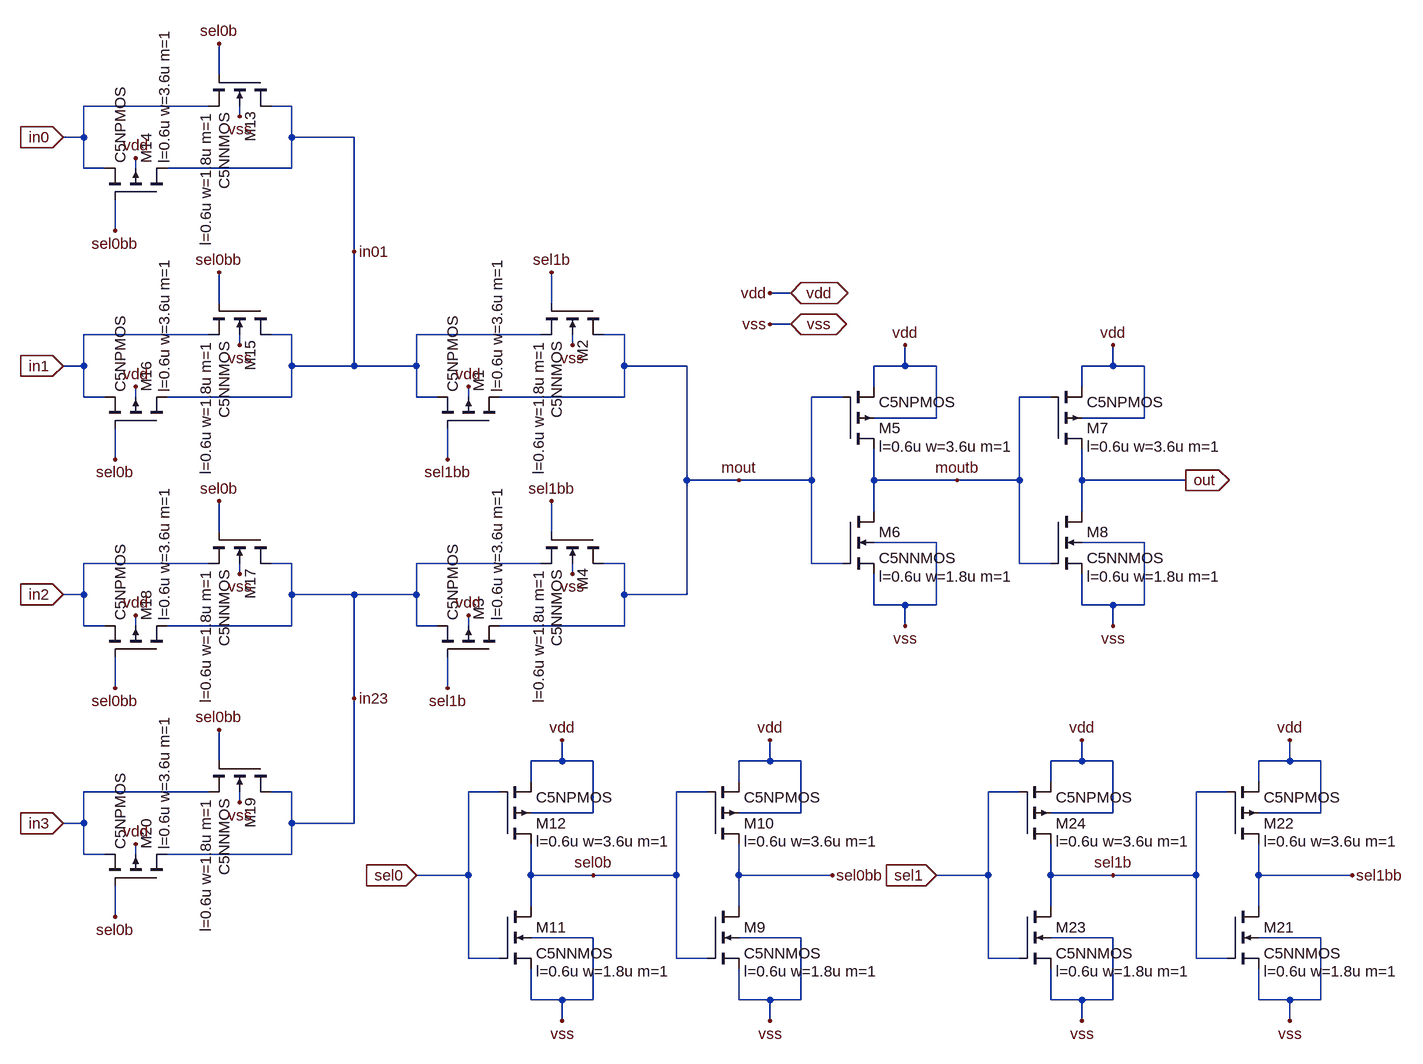
[diagram p0: schematic mux4to1_1x.asc]
mux4to1_1x.asc, the LTspice schematic file:
Version 4
SHEET 1 1484 1076
WIRE -352 -464 -352 -512
WIRE -368 -416 -560 -416
WIRE -240 -416 -272 -416
WIRE -320 -400 -320 -416
WIRE -560 -368 -560 -416
WIRE -560 -368 -592 -368
WIRE -240 -368 -240 -416
WIRE -144 -368 -240 -368
WIRE -560 -320 -560 -368
WIRE -528 -320 -560 -320
WIRE -480 -320 -480 -336
WIRE -240 -320 -240 -368
WIRE -240 -320 -432 -320
WIRE -512 -224 -512 -272
WIRE -144 -192 -144 -368
WIRE 528 -128 496 -128
WIRE -352 -112 -352 -160
WIRE 160 -112 160 -160
WIRE 528 -80 496 -80
WIRE -368 -64 -560 -64
WIRE -240 -64 -272 -64
WIRE 144 -64 -48 -64
WIRE 272 -64 240 -64
WIRE -320 -48 -320 -64
WIRE 192 -48 192 -64
WIRE -560 -16 -560 -64
WIRE -560 -16 -592 -16
WIRE -240 -16 -240 -64
WIRE -144 -16 -144 -192
WIRE -144 -16 -240 -16
WIRE -48 -16 -48 -64
WIRE -48 -16 -144 -16
WIRE 272 -16 272 -64
WIRE 368 -16 272 -16
WIRE 704 -16 704 -48
WIRE 704 -16 656 -16
WIRE 752 -16 704 -16
WIRE 1024 -16 1024 -48
WIRE 1024 -16 976 -16
WIRE 1072 -16 1024 -16
WIRE 656 16 656 -16
WIRE 976 16 976 -16
WIRE -560 32 -560 -16
WIRE -528 32 -560 32
WIRE -480 32 -480 16
WIRE -240 32 -240 -16
WIRE -240 32 -432 32
WIRE -48 32 -48 -16
WIRE -16 32 -48 32
WIRE 32 32 32 16
WIRE 272 32 272 -16
WIRE 272 32 80 32
WIRE 608 32 560 32
WIRE 928 32 880 32
WIRE 752 64 752 -16
WIRE 752 64 656 64
WIRE 1072 64 1072 -16
WIRE 1072 64 976 64
WIRE -512 128 -512 80
WIRE 0 128 0 80
WIRE 368 160 368 -16
WIRE 448 160 368 160
WIRE 560 160 560 32
WIRE 560 160 448 160
WIRE 656 160 656 112
WIRE 784 160 656 160
WIRE 880 160 880 32
WIRE 880 160 784 160
WIRE 976 160 976 112
WIRE 1136 160 976 160
WIRE 656 208 656 160
WIRE 976 208 976 160
WIRE -352 240 -352 192
WIRE 160 240 160 192
WIRE 752 256 656 256
WIRE 1072 256 976 256
WIRE -368 288 -560 288
WIRE -240 288 -272 288
WIRE 144 288 -48 288
WIRE 272 288 240 288
WIRE 560 288 560 160
WIRE 608 288 560 288
WIRE 880 288 880 160
WIRE 928 288 880 288
WIRE -320 304 -320 288
WIRE 192 304 192 288
WIRE -560 336 -560 288
WIRE -560 336 -592 336
WIRE -240 336 -240 288
WIRE -144 336 -240 336
WIRE -48 336 -48 288
WIRE -48 336 -144 336
WIRE 272 336 272 288
WIRE 368 336 368 160
WIRE 368 336 272 336
WIRE 656 352 656 304
WIRE 704 352 656 352
WIRE 752 352 752 256
WIRE 752 352 704 352
WIRE 976 352 976 304
WIRE 1024 352 976 352
WIRE 1072 352 1072 256
WIRE 1072 352 1024 352
WIRE -560 384 -560 336
WIRE -528 384 -560 384
WIRE -480 384 -480 368
WIRE -240 384 -240 336
WIRE -240 384 -432 384
WIRE -48 384 -48 336
WIRE -16 384 -48 384
WIRE 32 384 32 368
WIRE 272 384 272 336
WIRE 272 384 80 384
WIRE 704 384 704 352
WIRE 1024 384 1024 352
WIRE -512 480 -512 432
WIRE 0 480 0 432
WIRE -144 496 -144 336
WIRE -352 592 -352 544
WIRE 176 592 176 560
WIRE 176 592 128 592
WIRE 224 592 176 592
WIRE 496 592 496 560
WIRE 496 592 448 592
WIRE 544 592 496 592
WIRE 976 592 976 560
WIRE 976 592 928 592
WIRE 1024 592 976 592
WIRE 1296 592 1296 560
WIRE 1296 592 1248 592
WIRE 1344 592 1296 592
WIRE 128 624 128 592
WIRE 448 624 448 592
WIRE 928 624 928 592
WIRE 1248 624 1248 592
WIRE -368 640 -560 640
WIRE -240 640 -272 640
WIRE 80 640 32 640
WIRE 400 640 352 640
WIRE 880 640 832 640
WIRE 1200 640 1152 640
WIRE -320 656 -320 640
WIRE 224 672 224 592
WIRE 224 672 128 672
WIRE 544 672 544 592
WIRE 544 672 448 672
WIRE 1024 672 1024 592
WIRE 1024 672 928 672
WIRE 1344 672 1344 592
WIRE 1344 672 1248 672
WIRE -560 688 -560 640
WIRE -560 688 -592 688
WIRE -240 688 -240 640
WIRE -144 688 -144 496
WIRE -144 688 -240 688
WIRE -560 736 -560 688
WIRE -528 736 -560 736
WIRE -480 736 -480 720
WIRE -240 736 -240 688
WIRE -240 736 -432 736
WIRE 32 768 32 640
WIRE 32 768 -48 768
WIRE 128 768 128 720
WIRE 224 768 128 768
WIRE 352 768 352 640
WIRE 352 768 224 768
WIRE 448 768 448 720
WIRE 592 768 448 768
WIRE 832 768 832 640
WIRE 832 768 752 768
WIRE 928 768 928 720
WIRE 1024 768 928 768
WIRE 1152 768 1152 640
WIRE 1152 768 1024 768
WIRE 1248 768 1248 720
WIRE 1392 768 1248 768
WIRE 128 816 128 768
WIRE 448 816 448 768
WIRE 928 816 928 768
WIRE 1248 816 1248 768
WIRE -512 832 -512 784
WIRE 224 864 128 864
WIRE 544 864 448 864
WIRE 1024 864 928 864
WIRE 1344 864 1248 864
WIRE 32 896 32 768
WIRE 80 896 32 896
WIRE 352 896 352 768
WIRE 400 896 352 896
WIRE 832 896 832 768
WIRE 880 896 832 896
WIRE 1152 896 1152 768
WIRE 1200 896 1152 896
WIRE 128 960 128 912
WIRE 176 960 128 960
WIRE 224 960 224 864
WIRE 224 960 176 960
WIRE 448 960 448 912
WIRE 496 960 448 960
WIRE 544 960 544 864
WIRE 544 960 496 960
WIRE 928 960 928 912
WIRE 976 960 928 960
WIRE 1024 960 1024 864
WIRE 1024 960 976 960
WIRE 1248 960 1248 912
WIRE 1296 960 1248 960
WIRE 1344 960 1344 864
WIRE 1344 960 1296 960
WIRE 176 992 176 960
WIRE 496 992 496 960
WIRE 976 992 976 960
WIRE 1296 992 1296 960
FLAG 1136 160 out
IOPIN 1136 160 Out
FLAG 528 -80 vss
IOPIN 528 -80 BiDir
FLAG 528 -128 vdd
IOPIN 528 -128 BiDir
FLAG 160 -160 sel1b
FLAG 0 128 sel1bb
FLAG 0 480 sel1b
FLAG 160 192 sel1bb
FLAG 704 -48 vdd
FLAG 1024 -48 vdd
FLAG 704 384 vss
FLAG 1024 384 vss
FLAG 192 -48 vss
FLAG 32 16 vdd
FLAG 32 368 vdd
FLAG 192 304 vss
FLAG 496 -128 vdd
FLAG 496 -80 vss
FLAG 176 560 vdd
FLAG 496 560 vdd
FLAG 176 992 vss
FLAG 496 992 vss
FLAG -48 768 sel0
IOPIN -48 768 In
FLAG 224 768 sel0b
FLAG 592 768 sel0bb
FLAG -592 -368 in0
IOPIN -592 -368 In
FLAG -592 -16 in1
IOPIN -592 -16 In
FLAG -352 -512 sel0b
FLAG -512 -224 sel0bb
FLAG -512 128 sel0b
FLAG -352 -160 sel0bb
FLAG -320 -400 vss
FLAG -480 -336 vdd
FLAG -480 16 vdd
FLAG -320 -48 vss
FLAG -592 336 in2
IOPIN -592 336 In
FLAG -592 688 in3
IOPIN -592 688 In
FLAG -352 192 sel0b
FLAG -512 480 sel0bb
FLAG -512 832 sel0b
FLAG -352 544 sel0bb
FLAG -320 304 vss
FLAG -480 368 vdd
FLAG -480 720 vdd
FLAG -320 656 vss
FLAG 976 560 vdd
FLAG 1296 560 vdd
FLAG 976 992 vss
FLAG 1296 992 vss
FLAG 752 768 sel1
IOPIN 752 768 In
FLAG 1024 768 sel1b
FLAG 1392 768 sel1bb
FLAG -144 496 in23
FLAG -144 -192 in01
FLAG 448 160 mout
FLAG 784 160 moutb
SYMBOL nmos4 928 208 R0
WINDOW 123 56 100 Left 2
SYMATTR Value2 l=0.6u w=1.8u m=1
SYMATTR InstName M8
SYMATTR Value C5NNMOS
SYMBOL pmos4 928 112 M180
WINDOW 123 56 4 Left 2
SYMATTR Value2 l=0.6u w=3.6u m=1
SYMATTR InstName M7
SYMATTR Value C5NPMOS
SYMBOL nmos4 608 208 R0
WINDOW 123 56 100 Left 2
SYMATTR Value2 l=0.6u w=1.8u m=1
SYMATTR InstName M6
SYMATTR Value C5NNMOS
SYMBOL pmos4 608 112 M180
WINDOW 123 56 4 Left 2
SYMATTR Value2 l=0.6u w=3.6u m=1
SYMATTR InstName M5
SYMATTR Value C5NPMOS
SYMBOL nmos4 240 -112 R90
WINDOW 123 56 100 Left 2
SYMATTR Value2 l=0.6u w=1.8u m=1
SYMATTR InstName M2
SYMATTR Value C5NNMOS
SYMBOL pmos4 80 80 M270
WINDOW 123 56 4 Left 2
SYMATTR Value2 l=0.6u w=3.6u m=1
SYMATTR InstName M1
SYMATTR Value C5NPMOS
SYMBOL nmos4 240 240 R90
WINDOW 123 56 100 Left 2
SYMATTR Value2 l=0.6u w=1.8u m=1
SYMATTR InstName M4
SYMATTR Value C5NNMOS
SYMBOL pmos4 80 432 M270
WINDOW 123 56 4 Left 2
SYMATTR Value2 l=0.6u w=3.6u m=1
SYMATTR InstName M3
SYMATTR Value C5NPMOS
SYMBOL nmos4 400 816 R0
WINDOW 123 56 100 Left 2
SYMATTR Value2 l=0.6u w=1.8u m=1
SYMATTR InstName M9
SYMATTR Value C5NNMOS
SYMBOL pmos4 400 720 M180
WINDOW 123 56 4 Left 2
SYMATTR Value2 l=0.6u w=3.6u m=1
SYMATTR InstName M10
SYMATTR Value C5NPMOS
SYMBOL nmos4 80 816 R0
WINDOW 123 56 100 Left 2
SYMATTR Value2 l=0.6u w=1.8u m=1
SYMATTR InstName M11
SYMATTR Value C5NNMOS
SYMBOL pmos4 80 720 M180
WINDOW 123 56 4 Left 2
SYMATTR Value2 l=0.6u w=3.6u m=1
SYMATTR InstName M12
SYMATTR Value C5NPMOS
SYMBOL nmos4 -272 -464 R90
WINDOW 123 56 100 Left 2
SYMATTR Value2 l=0.6u w=1.8u m=1
SYMATTR InstName M13
SYMATTR Value C5NNMOS
SYMBOL pmos4 -432 -272 M270
WINDOW 123 56 4 Left 2
SYMATTR Value2 l=0.6u w=3.6u m=1
SYMATTR InstName M14
SYMATTR Value C5NPMOS
SYMBOL nmos4 -272 -112 R90
WINDOW 123 56 100 Left 2
SYMATTR Value2 l=0.6u w=1.8u m=1
SYMATTR InstName M15
SYMATTR Value C5NNMOS
SYMBOL pmos4 -432 80 M270
WINDOW 123 56 4 Left 2
SYMATTR Value2 l=0.6u w=3.6u m=1
SYMATTR InstName M16
SYMATTR Value C5NPMOS
SYMBOL nmos4 -272 240 R90
WINDOW 123 56 100 Left 2
SYMATTR Value2 l=0.6u w=1.8u m=1
SYMATTR InstName M17
SYMATTR Value C5NNMOS
SYMBOL pmos4 -432 432 M270
WINDOW 123 56 4 Left 2
SYMATTR Value2 l=0.6u w=3.6u m=1
SYMATTR InstName M18
SYMATTR Value C5NPMOS
SYMBOL nmos4 -272 592 R90
WINDOW 123 56 100 Left 2
SYMATTR Value2 l=0.6u w=1.8u m=1
SYMATTR InstName M19
SYMATTR Value C5NNMOS
SYMBOL pmos4 -432 784 M270
WINDOW 123 56 4 Left 2
SYMATTR Value2 l=0.6u w=3.6u m=1
SYMATTR InstName M20
SYMATTR Value C5NPMOS
SYMBOL nmos4 1200 816 R0
WINDOW 123 56 100 Left 2
SYMATTR Value2 l=0.6u w=1.8u m=1
SYMATTR InstName M21
SYMATTR Value C5NNMOS
SYMBOL pmos4 1200 720 M180
WINDOW 123 56 4 Left 2
SYMATTR Value2 l=0.6u w=3.6u m=1
SYMATTR InstName M22
SYMATTR Value C5NPMOS
SYMBOL nmos4 880 816 R0
WINDOW 123 56 100 Left 2
SYMATTR Value2 l=0.6u w=1.8u m=1
SYMATTR InstName M23
SYMATTR Value C5NNMOS
SYMBOL pmos4 880 720 M180
WINDOW 123 56 4 Left 2
SYMATTR Value2 l=0.6u w=3.6u m=1
SYMATTR InstName M24
SYMATTR Value C5NPMOS

The netlist it stands for:
* mux4to1_1x.asc
M8 out moutb vss vss C5NNMOS l=0.6u w=1.8u m=1
M7 out moutb vdd vdd C5NPMOS l=0.6u w=3.6u m=1
M6 moutb mout vss vss C5NNMOS l=0.6u w=1.8u m=1
M5 moutb mout vdd vdd C5NPMOS l=0.6u w=3.6u m=1
M2 mout sel1b in01 vss C5NNMOS l=0.6u w=1.8u m=1
M1 mout sel1bb in01 vdd C5NPMOS l=0.6u w=3.6u m=1
M4 mout sel1bb in23 vss C5NNMOS l=0.6u w=1.8u m=1
M3 mout sel1b in23 vdd C5NPMOS l=0.6u w=3.6u m=1
M9 sel0bb sel0b vss vss C5NNMOS l=0.6u w=1.8u m=1
M10 sel0bb sel0b vdd vdd C5NPMOS l=0.6u w=3.6u m=1
M11 sel0b sel0 vss vss C5NNMOS l=0.6u w=1.8u m=1
M12 sel0b sel0 vdd vdd C5NPMOS l=0.6u w=3.6u m=1
M13 in01 sel0b in0 vss C5NNMOS l=0.6u w=1.8u m=1
M14 in01 sel0bb in0 vdd C5NPMOS l=0.6u w=3.6u m=1
M15 in01 sel0bb in1 vss C5NNMOS l=0.6u w=1.8u m=1
M16 in01 sel0b in1 vdd C5NPMOS l=0.6u w=3.6u m=1
M17 in23 sel0b in2 vss C5NNMOS l=0.6u w=1.8u m=1
M18 in23 sel0bb in2 vdd C5NPMOS l=0.6u w=3.6u m=1
M19 in23 sel0bb in3 vss C5NNMOS l=0.6u w=1.8u m=1
M20 in23 sel0b in3 vdd C5NPMOS l=0.6u w=3.6u m=1
M21 sel1bb sel1b vss vss C5NNMOS l=0.6u w=1.8u m=1
M22 sel1bb sel1b vdd vdd C5NPMOS l=0.6u w=3.6u m=1
M23 sel1b sel1 vss vss C5NNMOS l=0.6u w=1.8u m=1
M24 sel1b sel1 vdd vdd C5NPMOS l=0.6u w=3.6u m=1
.model NMOS NMOS
.model PMOS PMOS
.lib standard.mos
.backanno
.end